# Altium schematic sheet Voeding.SchDoc
size A4; Address1: PXL EAI 1001; Revision: V 1.0; SheetNumber: 2; SheetTotal: 5
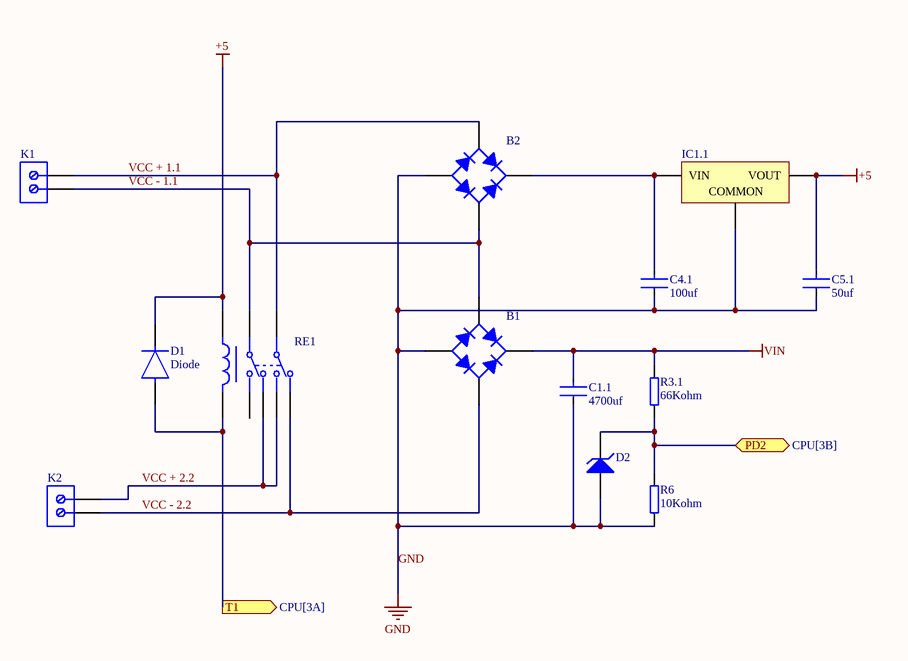
[diagram p0: Voeding.SchDoc]

## Parts
B1  Bridge_Rectifier  [ttf]  (value not drawn)
B2  Bridge_Rectifier  [ttf]  (value not drawn)
C1.1  4700uf  [CE_D25_L25_plugin]
C4.1  100uf  [CC_0805_L]
C5.1  50uf  [CC_0805_L]
D1  Diode  [SOD-123FL]
D2  Zener_Diode  [SOD-123FL]  (value not drawn)
IC1.1  OKI-78SR-5/1.5-W36-C  [OKI78SR515W36C]  (value not drawn)
K1  282836-2  [terminal_block]  (value not drawn)
K2  282836-2  [terminal_block]  (value not drawn)
R3.1  66Kohm  [CC_0805_m]
R6  10Kohm  [CC_0805_m]
RE1  RELAY_GENERAL_PURPOSE  [RT42]  (value not drawn)

## Ports
PD2 (bidir, see CPU[3B]), T1 (out, see CPU[3A])

## Nets
+5: C5.1.1 D1.1(C) IC1.1.3(VOUT) RE1.A1
GND: B1.2(A) B2.2(A) C1.1.2 C4.1.2 C5.1.2 D2.2(A) IC1.1.2(COMMON) R6.2
VIN: B1.1(K) C1.1.1 R3.1.1
PD2: D2.1(K) R3.1.2 R6.1 ; port PD2
T1: D1.2(A) RE1.A2 ; port T1
VCC + 1.1: B2.3(C) K1.2 RE1.21
VCC + 2.2: K2.2 RE1.12 RE1.24
VCC - 1.1: B1.3(C) B2.4(C) K1.1 RE1.11
VCC - 2.2: B1.4(C) K2.1 RE1.22
NetB2_1: B2.1(K) C4.1.1 IC1.1.1(VIN)

Not connected (* = marked no-connect by the designer): RE1 14

## Library data of the parts
B1 B2 = Bridge_Rectifier: Manufacturer: Diodes Inc; Average Rectified Current-Max: 0.8A; Reverse Voltage-Max [Vrrm]: 600V; Forward Voltage: 1V; Peak Current-Max: 30A; Reverse Current-Max: 5µA; Package Version: 05/2016; Package URL: http://www.diodes.com/_files/packages/MiniDIP.pdf; Datasheet Version: Rev. 13-2, 12/2010; Datasheet URL: http://www.diodes.com/_files/datasheets/ds17003.pdf; Mounting Technology: SurfaceMount; Manufacturer URL: http://www.diodes.com/; Package Reference: MiniDIP-4; Package Description: 4-Pin Small Outline Integrated Circuit, Body 4.7 x 3.8 mm, Pitch 2.5 mm
C1.1 C4.1 C5.1 = Capacitor_Ceramic: Manufacturer: KEMET; Manufacturer Part Number: C0805C224K5RACTU; Value: 0.22 μF; Temperature Characteristic: X7R; Temperature Coefficient: 30ppm/°C; Tolerance: 0.1; Voltage Rating: 50 V; ComponentLink2URL: https://content.kemet.com/datasheets/KEM_C1003_C0G_SMD.pdf; Device Class L3: Ceramic Capacitors; Lead Free: Yes; Temperature: -55°C to +125°C; RoHS: TRUE; Capacitance: 0.22 μF; Automotive: No; Material: Ceramic; Octopart: https://octopart.com/c0805c224k5ractu-kemet-144670; Temperature Range Low: -55°C; Height: 0.88mm; Device Class L1: Passive Components; Digikey Description: CAP CER 0.22UF 50V X7R 0805; ComponentLink2Description: Datasheet; Mouser Description: CAP CER 0.22UF 50V X7R 0805; Category: Cap; Ipc Land Pattern Name: CAPC200125X78; Temperature Range High: +125°C; Package: C0805C-DN; Device Class L2: Capacitors
D1 = Diode: Manufacturer Part Number: 1N4007; Manufacturer: Diotec; Max Surge Forward Current: 27A; Forward Current: 1A; Max Junction Temp: +175°C; Reverse Voltage: 1000V; Value: 15pF; Peak Reverse Current: 5uA; Category: Diode; Temperature Range Low: -50°C; Automotive: No; Temperature: -50°C to +175°C; Lead Free: Yes; ComponentLink2Description: Datasheet; Max Repetitive Reverse Voltage: 1000V; ComponentLink2URL: https://datasheet.octopart.com/1N4007-Diotec-datasheet-62346875.pdf; Device Class L3: Rectifier Diodes; Height: 2.8mm; Octopart: https://octopart.com/1n4007-diotec-4040411; Package: 1N4007; Temperature Range High: +175°C; Device Class L1: Discrete Semiconductors; Device Class L2: Diodes; RoHS: TRUE; Capacitance: 15pF; Ipc Land Pattern Name: DIOAD888W100L520D280
D2 = Zener_Diode: Manufacturer: On Semiconductor; PartNumber: 1SMB5920BT3G; Packing: Tape and Reel; VZ Typ (V): 6.2; PackageDescription: 2-Pin Small Molded Package, J-Bend Lead, Body 4.33 x 3.625 mm; Mounting Technology: Surface Mount; PackageVersion: Rev. H, 05/2011; ComponentLink1Description: Manufacturer URL; RoHS: Pb-Free; DatasheetVersion: Rev. 8; ComponentLink2Description: Datasheet; ComponentLink2URL: http://www.onsemi.com/pub_link/Collateral/1SMB5913BT3-D.PDF; ComponentLink1URL: http://www.onsemi.com/; ComponentLink3Description: Package Specification; PackageReference: SMB-2-403A-03_H; ComponentLink3URL: http://www.onsemi.com/pub_link/Collateral/1SMB5913BT3-D.PDF
IC1.1 = OKI-78SR-5/1.5-W36-C: Non-Isolated DC/DC Converter, 7.5 W, 7 to 36 V, 1.5 A, -40 to 85 degC, 3-Pin THD, RoHS; Manufacturer: Murata; Current - Output (Max): 1.5A; Power (Watts) - Max: 8W; Efficiency: 90.5%; Voltage - Input (Min): 7V; Voltage - Input (Max): 36V; Voltage - Output 1: 5V; Number of Outputs: 1; Package / Case: 3-SIPModule; Features: SCP; Type: LinearRegulatorReplacement; Size / Dimension: 0.41"Lx0.30"Wx0.65"H(10.4mmx7.6mmx16.5mm); Datasheet URL: https://datasheet.ciiva.com/8006/1790439-8006672.pdf; Datasheet Version: Oct-13; Power (Watts) - Manufacture Series: 8W; Voltage - Output 2: -; Series: Okami™OKI-78SR; Family: DCDCConverters; Manufacturer URL: http://www.murata.com/; Category: PowerSupplies-BoardMount; Voltage - Isolation: -; Packaging: Tube; Applications: ITE(Commercial); Mounting Type: ThroughHole; Voltage - Output 3: -; Operating Temperature: -40degC~85degC
K1 K2 = 1x2 terminal block: Female Header, Pitch 5 mm, 1 x 2 Position, Height 10 mm, Tail Length 3.5 mm, Rohs, Bulk; Manufacturer: TE Connectivity; Wire Gauge: 16-30AWG; Product Training Modules: Wire-to-BoardEurostyleTerminalBlocks; Clamp Material - Plating: Brass-NickelPlated; Voltage: 300V; Mating Orientation: HorizontalwithBoard; Current: 13.5A; Pitch: 0.197"(5.00mm); Screw Thread: M3; 3D Model: 282836-2.pdf; Other Names: 5ULV-02B / A98076; Dynamic Catalog: BuchananSeries; Number of Levels: 1; Torque - Screw: 0.68Nm(6Lb-In); Featured Product: EurostyleTerminalBlockConnectors; Positions Per Level: 2; Wire Termination: Screw-RisingCageClamp; Datasheet URL: http://www.te.com.cn/commerce/DocumentDelivery/DDEController?Action=showdoc&DocId=Catalog+Section%7F1308389_EUROSTYLE_TERMINAL_BLOCKS%7F0607%7Fpdf%7FEnglish%7FENG_CS_1308389_EUROSTYLE_TERMINAL_BLOCKS_0607.pdf%7F282836-2; Color: Green; Family: TerminalBlocks-WiretoBoard; RoHS Information: 282836-2StatementofCompliance; Standard Package: 300; Contact Material - Plating: Brass-TinPlated; Manufacturer URL: http://www.te.com; Housing Material: Polyamide(PA66),Nylon6/6; Features: Interlocking(Side); Package Description: Female Header, Pitch 5 mm, 1 x 2 Position, Height 10 mm, Tail Length 3.5 mm; Mounting Type: ThroughHole; Package Reference: THD; Packaging: Bulk; Series: Buchanan; Category: Connectors,Interconnects; Screw Material - Plating: Brass-NickelPlated
R3.1 R6 = Resistor: Manufacturer: Vishay Dale; Part Number: CRCW08050000Z0EA
RE1 = RELAY_GENERAL_PURPOSE: Manufacturer Part Number: RT424005; Manufacturer: TE Connectivity; Coil Power: 403mW; Throw Configuration: DPDT; Coil Voltage: 5V; Number Of Contacts: 2; Coil Resistance: 62Ω; Current Rating: 8A; Coil Type: Non-Latching; Category: Relay; Octopart: https://octopart.com/5-1393243-9-te+connectivity-41835766; Device Class L3: Power Relays; ComponentLink2URL: https://www.te.com/commerce/DocumentDelivery/DDEController?Action=showdoc&DocId=Data+Sheet%7FRT2%7F1014%7Fpdf%7FEnglish%7FENG_DS_RT2_1014.pdf%7F5-1393243-9; Ambient Temperature Range High: +85°C; ComponentLink2Description: Datasheet; Digikey Description: RELAY GENERAL PURPOSE DPDT 8A 5V; Package: RT424005; Automotive: No; Device Class L1: Electromechanical; Height: 15.7mm; Device Class L2: Relays; Ambient Temperature Range Low: -40°C; Mouser Description: General Purpose Relay, Rt2 Series, Power, Non Latching, Dpdt, 5 Vdc, 8 A Rohs Compliant: Yes; Lead Free: Yes; RoHS: TRUE